# Altium project Hydrogen Bike BMS (100V).PrjPcb (part 3 of 3)

## Sheet Voltage_Sensing.SchDoc
size A; SheetNumber: 7; SheetTotal: 9
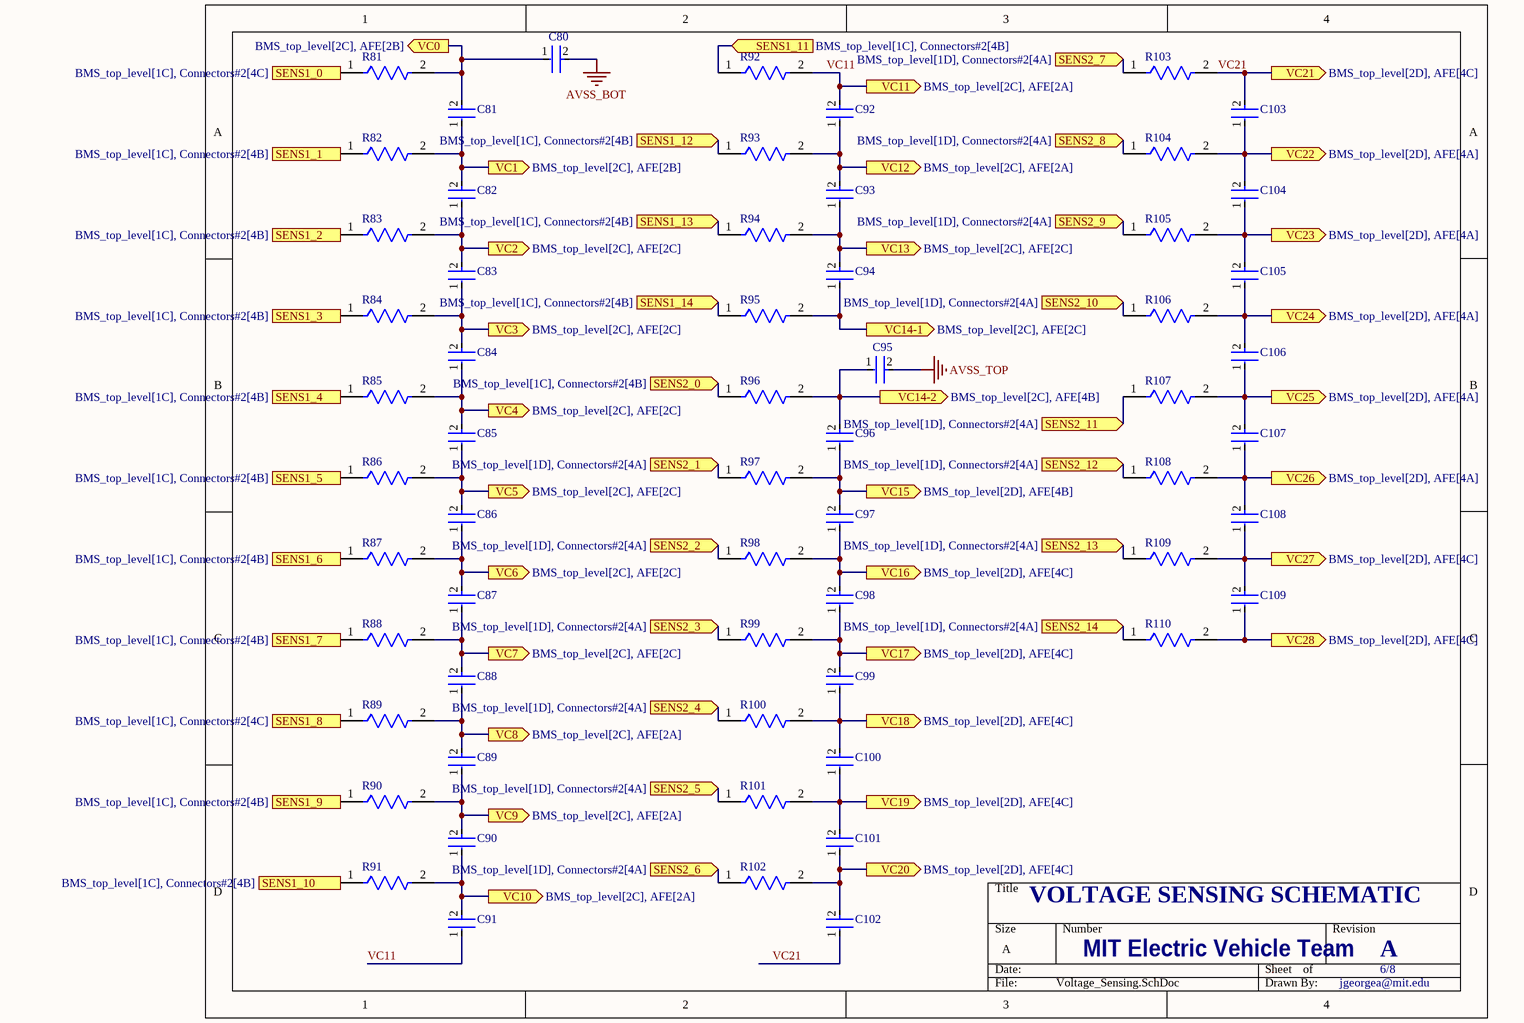
[diagram p7: Voltage_Sensing.SchDoc]

### Parts
C80  C1608X7R1C474K080AC  [FP-C1608-080-0_1-IPC_C]  (value not drawn)
C81  C1608X7R1C474K080AC  [FP-C1608-080-0_1-IPC_C]  (value not drawn)
C82  C1608X7R1C474K080AC  [FP-C1608-080-0_1-IPC_C]  (value not drawn)
C83  C1608X7R1C474K080AC  [FP-C1608-080-0_1-IPC_C]  (value not drawn)
C84  C1608X7R1C474K080AC  [FP-C1608-080-0_1-IPC_C]  (value not drawn)
C85  C1608X7R1C474K080AC  [FP-C1608-080-0_1-IPC_C]  (value not drawn)
C86  C1608X7R1C474K080AC  [FP-C1608-080-0_1-IPC_C]  (value not drawn)
C87  C1608X7R1C474K080AC  [FP-C1608-080-0_1-IPC_C]  (value not drawn)
C88  C1608X7R1C474K080AC  [FP-C1608-080-0_1-IPC_C]  (value not drawn)
C89  C1608X7R1C474K080AC  [FP-C1608-080-0_1-IPC_C]  (value not drawn)
C90  C1608X7R1C474K080AC  [FP-C1608-080-0_1-IPC_C]  (value not drawn)
C91  C1608X7R1C474K080AC  [FP-C1608-080-0_1-IPC_C]  (value not drawn)
C92  C1608X7R1C474K080AC  [FP-C1608-080-0_1-IPC_C]  (value not drawn)
C93  C1608X7R1C474K080AC  [FP-C1608-080-0_1-IPC_C]  (value not drawn)
C94  C1608X7R1C474K080AC  [FP-C1608-080-0_1-IPC_C]  (value not drawn)
C95  C1608X7R1C474K080AC  [FP-C1608-080-0_1-IPC_C]  (value not drawn)
C96  C1608X7R1C474K080AC  [FP-C1608-080-0_1-IPC_C]  (value not drawn)
C97  C1608X7R1C474K080AC  [FP-C1608-080-0_1-IPC_C]  (value not drawn)
C98  C1608X7R1C474K080AC  [FP-C1608-080-0_1-IPC_C]  (value not drawn)
C99  C1608X7R1C474K080AC  [FP-C1608-080-0_1-IPC_C]  (value not drawn)
C100  C1608X7R1C474K080AC  [FP-C1608-080-0_1-IPC_C]  (value not drawn)
C101  C1608X7R1C474K080AC  [FP-C1608-080-0_1-IPC_C]  (value not drawn)
C102  C1608X7R1C474K080AC  [FP-C1608-080-0_1-IPC_C]  (value not drawn)
C103  C1608X7R1C474K080AC  [FP-C1608-080-0_1-IPC_C]  (value not drawn)
C104  C1608X7R1C474K080AC  [FP-C1608-080-0_1-IPC_C]  (value not drawn)
C105  C1608X7R1C474K080AC  [FP-C1608-080-0_1-IPC_C]  (value not drawn)
C106  C1608X7R1C474K080AC  [FP-C1608-080-0_1-IPC_C]  (value not drawn)
C107  C1608X7R1C474K080AC  [FP-C1608-080-0_1-IPC_C]  (value not drawn)
C108  C1608X7R1C474K080AC  [FP-C1608-080-0_1-IPC_C]  (value not drawn)
C109  C1608X7R1C474K080AC  [FP-C1608-080-0_1-IPC_C]  (value not drawn)
R81  CRCW0805100RJNEAHP  [FP-CRCW0805-HPe3-IPC_C]  (value not drawn)
R82  CRCW0805100RJNEAHP  [FP-CRCW0805-HPe3-IPC_C]  (value not drawn)
R83  CRCW0805100RJNEAHP  [FP-CRCW0805-HPe3-IPC_C]  (value not drawn)
R84  CRCW0805100RJNEAHP  [FP-CRCW0805-HPe3-IPC_C]  (value not drawn)
R85  CRCW0805100RJNEAHP  [FP-CRCW0805-HPe3-IPC_C]  (value not drawn)
R86  CRCW0805100RJNEAHP  [FP-CRCW0805-HPe3-IPC_C]  (value not drawn)
R87  CRCW0805100RJNEAHP  [FP-CRCW0805-HPe3-IPC_C]  (value not drawn)
R88  CRCW0805100RJNEAHP  [FP-CRCW0805-HPe3-IPC_C]  (value not drawn)
R89  CRCW0805100RJNEAHP  [FP-CRCW0805-HPe3-IPC_C]  (value not drawn)
R90  CRCW0805100RJNEAHP  [FP-CRCW0805-HPe3-IPC_C]  (value not drawn)
R91  CRCW0805100RJNEAHP  [FP-CRCW0805-HPe3-IPC_C]  (value not drawn)
R92  CRCW0805100RJNEAHP  [FP-CRCW0805-HPe3-IPC_C]  (value not drawn)
R93  CRCW0805100RJNEAHP  [FP-CRCW0805-HPe3-IPC_C]  (value not drawn)
R94  CRCW0805100RJNEAHP  [FP-CRCW0805-HPe3-IPC_C]  (value not drawn)
R95  CRCW0805100RJNEAHP  [FP-CRCW0805-HPe3-IPC_C]  (value not drawn)
R96  CRCW0805100RJNEAHP  [FP-CRCW0805-HPe3-IPC_C]  (value not drawn)
R97  CRCW0805100RJNEAHP  [FP-CRCW0805-HPe3-IPC_C]  (value not drawn)
R98  CRCW0805100RJNEAHP  [FP-CRCW0805-HPe3-IPC_C]  (value not drawn)
R99  CRCW0805100RJNEAHP  [FP-CRCW0805-HPe3-IPC_C]  (value not drawn)
R100  CRCW0805100RJNEAHP  [FP-CRCW0805-HPe3-IPC_C]  (value not drawn)
R101  CRCW0805100RJNEAHP  [FP-CRCW0805-HPe3-IPC_C]  (value not drawn)
R102  CRCW0805100RJNEAHP  [FP-CRCW0805-HPe3-IPC_C]  (value not drawn)
R103  CRCW0805100RJNEAHP  [FP-CRCW0805-HPe3-IPC_C]  (value not drawn)
R104  CRCW0805100RJNEAHP  [FP-CRCW0805-HPe3-IPC_C]  (value not drawn)
R105  CRCW0805100RJNEAHP  [FP-CRCW0805-HPe3-IPC_C]  (value not drawn)
R106  CRCW0805100RJNEAHP  [FP-CRCW0805-HPe3-IPC_C]  (value not drawn)
R107  CRCW0805100RJNEAHP  [FP-CRCW0805-HPe3-IPC_C]  (value not drawn)
R108  CRCW0805100RJNEAHP  [FP-CRCW0805-HPe3-IPC_C]  (value not drawn)
R109  CRCW0805100RJNEAHP  [FP-CRCW0805-HPe3-IPC_C]  (value not drawn)
R110  CRCW0805100RJNEAHP  [FP-CRCW0805-HPe3-IPC_C]  (value not drawn)

### Ports
SENS1_0 (in, see BMS_top_level[1C], Connectors#2[4C]), SENS1_1 (in, see BMS_top_level[1C], Connectors#2[4B]), SENS1_2 (in, see BMS_top_level[1C], Connectors#2[4B]), SENS1_3 (in, see BMS_top_level[1C], Connectors#2[4B]), SENS1_4 (in, see BMS_top_level[1C], Connectors#2[4B]), SENS1_5 (in, see BMS_top_level[1C], Connectors#2[4B]), SENS1_6 (in, see BMS_top_level[1C], Connectors#2[4B]), SENS1_7 (in, see BMS_top_level[1C], Connectors#2[4B]), SENS1_8 (in, see BMS_top_level[1C], Connectors#2[4C]), SENS1_9 (in, see BMS_top_level[1C], Connectors#2[4B]), SENS1_10 (in, see BMS_top_level[1C], Connectors#2[4B]), SENS1_11 (in, see BMS_top_level[1C], Connectors#2[4B]), SENS1_12 (in, see BMS_top_level[1C], Connectors#2[4B]), SENS1_13 (in, see BMS_top_level[1C], Connectors#2[4B]), SENS1_14 (in, see BMS_top_level[1C], Connectors#2[4B]), SENS2_0 (in, see BMS_top_level[1C], Connectors#2[4B]), SENS2_1 (in, see BMS_top_level[1D], Connectors#2[4A]), SENS2_2 (in, see BMS_top_level[1D], Connectors#2[4A]), SENS2_3 (in, see BMS_top_level[1D], Connectors#2[4A]), SENS2_4 (in, see BMS_top_level[1D], Connectors#2[4A]), SENS2_5 (in, see BMS_top_level[1D], Connectors#2[4A]), SENS2_6 (in, see BMS_top_level[1D], Connectors#2[4A]), SENS2_7 (in, see BMS_top_level[1D], Connectors#2[4A]), SENS2_8 (in, see BMS_top_level[1D], Connectors#2[4A]), SENS2_9 (in, see BMS_top_level[1D], Connectors#2[4A]), SENS2_10 (in, see BMS_top_level[1D], Connectors#2[4A]), SENS2_11 (in, see BMS_top_level[1D], Connectors#2[4A]), SENS2_12 (in, see BMS_top_level[1D], Connectors#2[4A]), SENS2_13 (in, see BMS_top_level[1D], Connectors#2[4A]), SENS2_14 (in, see BMS_top_level[1D], Connectors#2[4A]), VC0 (out, see BMS_top_level[2C], AFE[2B]), VC1 (out, see BMS_top_level[2C], AFE[2B]), VC2 (out, see BMS_top_level[2C], AFE[2C]), VC3 (out, see BMS_top_level[2C], AFE[2C]), VC4 (out, see BMS_top_level[2C], AFE[2C]), VC5 (out, see BMS_top_level[2C], AFE[2C]), VC6 (out, see BMS_top_level[2C], AFE[2C]), VC7 (out, see BMS_top_level[2C], AFE[2C]), VC8 (out, see BMS_top_level[2C], AFE[2A]), VC9 (out, see BMS_top_level[2C], AFE[2A]), VC10 (out, see BMS_top_level[2C], AFE[2A]), VC11 (out, see BMS_top_level[2C], AFE[2A]), VC12 (out, see BMS_top_level[2C], AFE[2A]), VC13 (out, see BMS_top_level[2C], AFE[2C]), VC14-1 (out, see BMS_top_level[2C], AFE[2C]), VC14-2 (out, see BMS_top_level[2C], AFE[4B]), VC15 (out, see BMS_top_level[2D], AFE[4B]), VC16 (out, see BMS_top_level[2D], AFE[4C]), VC17 (out, see BMS_top_level[2D], AFE[4C]), VC18 (out, see BMS_top_level[2D], AFE[4C]), VC19 (out, see BMS_top_level[2D], AFE[4C]), VC20 (out, see BMS_top_level[2D], AFE[4C]), VC21 (out, see BMS_top_level[2D], AFE[4C]), VC22 (out, see BMS_top_level[2D], AFE[4A]), VC23 (out, see BMS_top_level[2D], AFE[4A]), VC24 (out, see BMS_top_level[2D], AFE[4A]), VC25 (out, see BMS_top_level[2D], AFE[4A]), VC26 (out, see BMS_top_level[2D], AFE[4A]), VC27 (out, see BMS_top_level[2D], AFE[4C]), VC28 (out, see BMS_top_level[2D], AFE[4C])

### Nets
AVSS_BOT: C80.2
AVSS_TOP: C95.2
VC11: C91.1 C92.2 R92.2 ; port VC11
VC21: C102.1 C103.2 R103.2 ; port VC21
NetC80_1: C80.1 C81.2 R81.2 ; port VC0
NetC81_1: C81.1 C82.2 R82.2 ; port VC1
NetC82_1: C82.1 C83.2 R83.2 ; port VC2
NetC83_1: C83.1 C84.2 R84.2 ; port VC3
NetC84_1: C84.1 C85.2 R85.2 ; port VC4
NetC85_1: C85.1 C86.2 R86.2 ; port VC5
NetC86_1: C86.1 C87.2 R87.2 ; port VC6
NetC87_1: C87.1 C88.2 R88.2 ; port VC7
NetC88_1: C88.1 C89.2 R89.2 ; port VC8
NetC89_1: C89.1 C90.2 R90.2 ; port VC9
NetC90_1: C90.1 C91.2 R91.2 ; port VC10
NetC92_1: C92.1 C93.2 R93.2 ; port VC12
NetC93_1: C93.1 C94.2 R94.2 ; port VC13
NetC94_1: C94.1 R95.2 ; port VC14-1
NetC95_1: C95.1 C96.2 R96.2 ; port VC14-2
NetC96_1: C96.1 C97.2 R97.2 ; port VC15
NetC97_1: C97.1 C98.2 R98.2 ; port VC16
NetC98_1: C98.1 C99.2 R99.2 ; port VC17
NetC99_1: C99.1 C100.2 R100.2 ; port VC18
NetC100_1: C100.1 C101.2 R101.2 ; port VC19
NetC101_1: C101.1 C102.2 R102.2 ; port VC20
NetC103_1: C103.1 C104.2 R104.2 ; port VC22
NetC104_1: C104.1 C105.2 R105.2 ; port VC23
NetC105_1: C105.1 C106.2 R106.2 ; port VC24
NetC106_1: C106.1 C107.2 R107.2 ; port VC25
NetC107_1: C107.1 C108.2 R108.2 ; port VC26
NetC108_1: C108.1 C109.2 R109.2 ; port VC27
NetC109_1: C109.1 R110.2 ; port VC28
NetJ6_1: R96.1 ; port SENS2_0
NetJ6_2: R97.1 ; port SENS2_1
NetJ6_3: R98.1 ; port SENS2_2
NetJ6_4: R99.1 ; port SENS2_3
NetJ6_5: R100.1 ; port SENS2_4
NetJ6_6: R101.1 ; port SENS2_5
NetJ6_7: R102.1 ; port SENS2_6
NetJ6_8: R103.1 ; port SENS2_7
NetJ6_9: R104.1 ; port SENS2_8
NetJ6_10: R105.1 ; port SENS2_9
NetJ6_11: R106.1 ; port SENS2_10
NetJ6_12: R107.1 ; port SENS2_11
NetJ6_13: R108.1 ; port SENS2_12
NetJ6_14: R109.1 ; port SENS2_13
NetJ6_15: R110.1 ; port SENS2_14
NetJ7_1: R81.1 ; port SENS1_0
NetJ7_2: R82.1 ; port SENS1_1
NetJ7_3: R83.1 ; port SENS1_2
NetJ7_4: R84.1 ; port SENS1_3
NetJ7_5: R85.1 ; port SENS1_4
NetJ7_6: R86.1 ; port SENS1_5
NetJ7_7: R87.1 ; port SENS1_6
NetJ7_8: R88.1 ; port SENS1_7
NetJ7_9: R89.1 ; port SENS1_8
NetJ7_10: R90.1 ; port SENS1_9
NetJ7_11: R91.1 ; port SENS1_10
NetJ7_12: R92.1 ; port SENS1_11
NetJ7_13: R93.1 ; port SENS1_12
NetJ7_14: R94.1 ; port SENS1_13
NetJ7_15: R95.1 ; port SENS1_14

### Notes on the sheet
- VOLTAGE SENSING SCHEMATIC
- MIT Electric Vehicle Team
- A
- 6/8
- jgeorgea@mit.edu

### Library data of the parts
C80-C109 = CMP-08246-006173-1: Multilayer Ceramic Capacitors 470nF ±10% 16V X7R SMD 0603; REACH SVHC: No SVHC; Number of Pins: 2; Thickness: 0.037inch; Lead Free: Lead Free; Voltage: 16V; Case Code (Imperial): 0603; Capacitance: 470nF; Length: 1.6mm; Dielectric: X7R; Resistor Type: Ceramic; Weight: 7.1E-05oz; Termination: SMD/SMT; Radiation Hardening: No; RoHS Compliant: Yes; Dielectric Material: Ceramic; Case Code (Metric): 1608; Construction: Flat; Voltage Rating (DC): 16V; Package Quantity: 1; Mount: Surface Mount; Min Operating Temperature: -55°C; Case/Package: 0603; Series: C; Max Operating Temperature: 125°C; Depth: 0.8mm; Voltage Rating: 16V; Width: 0.031inch; Tolerance: 10%; Height: 0.8mm; Packaging: Tape and Reel
R81-R110 = CMP-02407-002130-1: RES Thick Film, 100Ω, 5%, 0.5W, 200ppm/°C, 0805; Voltage Rating: 150V; Resistance: 100R; Power Rating: 330mW; Max Power Dissipation: 333mW; Max Operating Temperature: 155°C; Temperature Coefficient: 200ppm/°C; Case Code (Imperial): 0805; Lead Free: Lead Free; Composition: Thick Film; Case/Package: 0805; Package Quantity: 1; Number of Terminations: 2; Contact Plating: Tin; Radiation Hardening: No; Case Code (Metric): 2012; Height: 0.024inch; Features: Automotive AEC-Q200; Length: 0.079inch; Tolerance: 5%; Width: 0.049inch; Packaging: Tape and Reel; Termination: SMD/SMT; Weight: 0.000194oz; Min Operating Temperature: -55°C

## Sheet Connectors#2.SchDoc
size A; SheetNumber: 9; SheetTotal: 9
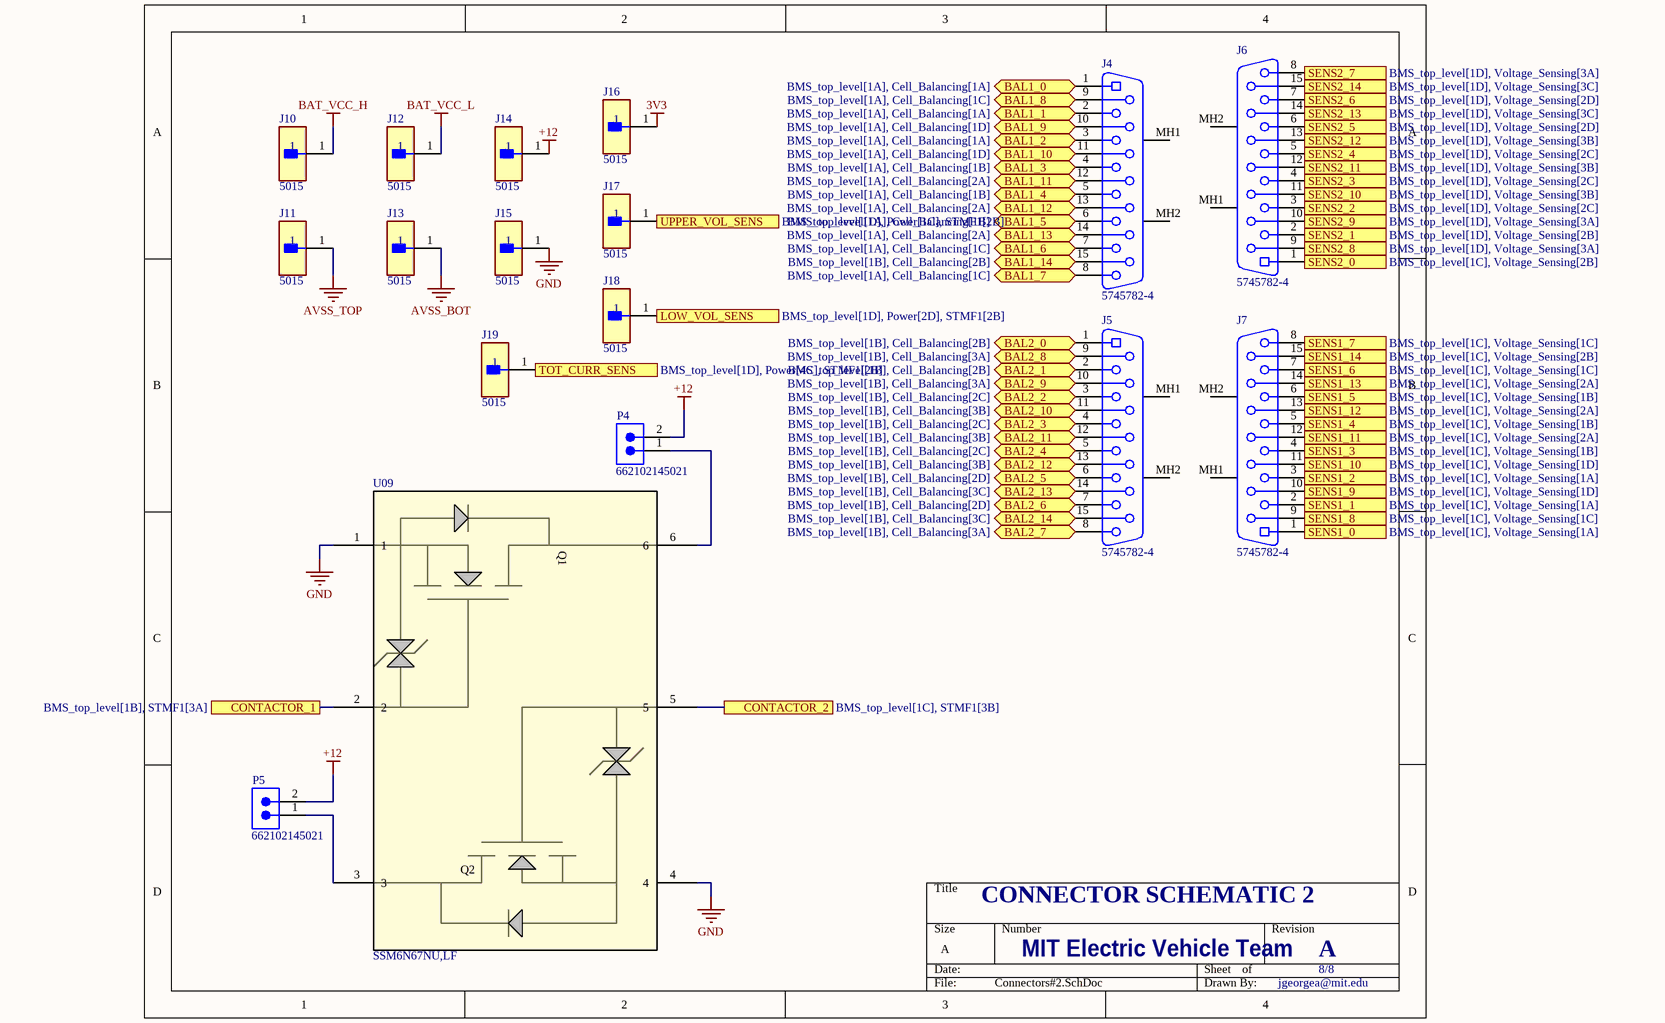
[diagram p8: Connectors#2.SchDoc]

### Parts
J4  5745782-4  [TECO-5745782-4_V]
J5  5745782-4  [TECO-5745782-4_V]
J6  5745782-4  [TECO-5745782-4_V]
J7  5745782-4  [TECO-5745782-4_V]
J10  5015  [FP-5015-MFG]
J11  5015  [FP-5015-MFG]
J12  5015  [FP-5015-MFG]
J13  5015  [FP-5015-MFG]
J14  5015  [FP-5015-MFG]
J15  5015  [FP-5015-MFG]
J16  5015  [FP-5015-MFG]
J17  5015  [FP-5015-MFG]
J18  5015  [FP-5015-MFG]
J19  5015  [FP-5015-MFG]
P4  662102145021  [662102145021]
P5  662102145021  [662102145021]
U09  SSM6N67NU,LF  [UDFN6_TOS]

### Ports
BAL1_0 (bidir, see BMS_top_level[1A], Cell_Balancing[1A]), BAL1_1 (bidir, see BMS_top_level[1A], Cell_Balancing[1A]), BAL1_2 (bidir, see BMS_top_level[1A], Cell_Balancing[1A]), BAL1_3 (bidir, see BMS_top_level[1A], Cell_Balancing[1B]), BAL1_4 (bidir, see BMS_top_level[1A], Cell_Balancing[1B]), BAL1_5 (bidir, see BMS_top_level[1A], Cell_Balancing[1B]), BAL1_6 (bidir, see BMS_top_level[1A], Cell_Balancing[1C]), BAL1_7 (bidir, see BMS_top_level[1A], Cell_Balancing[1C]), BAL1_8 (bidir, see BMS_top_level[1A], Cell_Balancing[1C]), BAL1_9 (bidir, see BMS_top_level[1A], Cell_Balancing[1D]), BAL1_10 (bidir, see BMS_top_level[1A], Cell_Balancing[1D]), BAL1_11 (bidir, see BMS_top_level[1A], Cell_Balancing[2A]), BAL1_12 (bidir, see BMS_top_level[1A], Cell_Balancing[2A]), BAL1_13 (bidir, see BMS_top_level[1A], Cell_Balancing[2A]), BAL1_14 (bidir, see BMS_top_level[1B], Cell_Balancing[2B]), BAL2_0 (bidir, see BMS_top_level[1B], Cell_Balancing[2B]), BAL2_1 (bidir, see BMS_top_level[1B], Cell_Balancing[2B]), BAL2_2 (bidir, see BMS_top_level[1B], Cell_Balancing[2C]), BAL2_3 (bidir, see BMS_top_level[1B], Cell_Balancing[2C]), BAL2_4 (bidir, see BMS_top_level[1B], Cell_Balancing[2C]), BAL2_5 (bidir, see BMS_top_level[1B], Cell_Balancing[2D]), BAL2_6 (bidir, see BMS_top_level[1B], Cell_Balancing[2D]), BAL2_7 (bidir, see BMS_top_level[1B], Cell_Balancing[3A]), BAL2_8 (bidir, see BMS_top_level[1B], Cell_Balancing[3A]), BAL2_9 (bidir, see BMS_top_level[1B], Cell_Balancing[3A]), BAL2_10 (bidir, see BMS_top_level[1B], Cell_Balancing[3B]), BAL2_11 (bidir, see BMS_top_level[1B], Cell_Balancing[3B]), BAL2_12 (bidir, see BMS_top_level[1B], Cell_Balancing[3B]), BAL2_13 (bidir, see BMS_top_level[1B], Cell_Balancing[3C]), BAL2_14 (bidir, see BMS_top_level[1B], Cell_Balancing[3C]), CONTACTOR_1 (see BMS_top_level[1B], STMF1[3A]), CONTACTOR_2 (see BMS_top_level[1C], STMF1[3B]), LOW_VOL_SENS (in, see BMS_top_level[1D], Power[2D], STMF1[2B]), SENS1_0 (out, see BMS_top_level[1C], Voltage_Sensing[1A]), SENS1_1 (out, see BMS_top_level[1C], Voltage_Sensing[1A]), SENS1_2 (out, see BMS_top_level[1C], Voltage_Sensing[1A]), SENS1_3 (out, see BMS_top_level[1C], Voltage_Sensing[1B]), SENS1_4 (out, see BMS_top_level[1C], Voltage_Sensing[1B]), SENS1_5 (out, see BMS_top_level[1C], Voltage_Sensing[1B]), SENS1_6 (out, see BMS_top_level[1C], Voltage_Sensing[1C]), SENS1_7 (out, see BMS_top_level[1C], Voltage_Sensing[1C]), SENS1_8 (out, see BMS_top_level[1C], Voltage_Sensing[1C]), SENS1_9 (out, see BMS_top_level[1C], Voltage_Sensing[1D]), SENS1_10 (out, see BMS_top_level[1C], Voltage_Sensing[1D]), SENS1_11 (out, see BMS_top_level[1C], Voltage_Sensing[2A]), SENS1_12 (out, see BMS_top_level[1C], Voltage_Sensing[2A]), SENS1_13 (out, see BMS_top_level[1C], Voltage_Sensing[2A]), SENS1_14 (out, see BMS_top_level[1C], Voltage_Sensing[2B]), SENS2_0 (out, see BMS_top_level[1C], Voltage_Sensing[2B]), SENS2_1 (out, see BMS_top_level[1D], Voltage_Sensing[2B]), SENS2_2 (out, see BMS_top_level[1D], Voltage_Sensing[2C]), SENS2_3 (out, see BMS_top_level[1D], Voltage_Sensing[2C]), SENS2_4 (out, see BMS_top_level[1D], Voltage_Sensing[2C]), SENS2_5 (out, see BMS_top_level[1D], Voltage_Sensing[2D]), SENS2_6 (out, see BMS_top_level[1D], Voltage_Sensing[2D]), SENS2_7 (out, see BMS_top_level[1D], Voltage_Sensing[3A]), SENS2_8 (out, see BMS_top_level[1D], Voltage_Sensing[3A]), SENS2_9 (out, see BMS_top_level[1D], Voltage_Sensing[3A]), SENS2_10 (out, see BMS_top_level[1D], Voltage_Sensing[3B]), SENS2_11 (out, see BMS_top_level[1D], Voltage_Sensing[3B]), SENS2_12 (out, see BMS_top_level[1D], Voltage_Sensing[3B]), SENS2_13 (out, see BMS_top_level[1D], Voltage_Sensing[3C]), SENS2_14 (out, see BMS_top_level[1D], Voltage_Sensing[3C]), TOT_CURR_SENS (in, see BMS_top_level[1D], Power[4C], STMF1[2B]), UPPER_VOL_SENS (in, see BMS_top_level[1D], Power[1C], STMF1[2B])

### Nets
3V3: J16.1
+12: J14.1 P4.2 P5.2
AVSS_BOT: J13.1
AVSS_TOP: J11.1
BAT_VCC_H: J10.1
BAT_VCC_L: J12.1
GND: J15.1 U09.1 U09.4
CON1: U09.2 ; port CONTACTOR_1
CON2: U09.5 ; port CONTACTOR_2
LOW_VOL: J18.1 ; port LOW_VOL_SENS
TOT_CURR: J19.1 ; port TOT_CURR_SENS
UPPER_VOL: J17.1 ; port UPPER_VOL_SENS
NetJ4_1: J4.1 ; port BAL1_0
NetJ4_2: J4.2 ; port BAL1_1
NetJ4_3: J4.3 ; port BAL1_2
NetJ4_4: J4.4 ; port BAL1_3
NetJ4_5: J4.5 ; port BAL1_4
NetJ4_6: J4.6 ; port BAL1_5
NetJ4_7: J4.7 ; port BAL1_6
NetJ4_8: J4.8 ; port BAL1_7
NetJ4_9: J4.9 ; port BAL1_8
NetJ4_10: J4.10 ; port BAL1_9
NetJ4_11: J4.11 ; port BAL1_10
NetJ4_12: J4.12 ; port BAL1_11
NetJ4_13: J4.13 ; port BAL1_12
NetJ4_14: J4.14 ; port BAL1_13
NetJ4_15: J4.15 ; port BAL1_14
NetJ5_1: J5.1 ; port BAL2_0
NetJ5_2: J5.2 ; port BAL2_1
NetJ5_3: J5.3 ; port BAL2_2
NetJ5_4: J5.4 ; port BAL2_3
NetJ5_5: J5.5 ; port BAL2_4
NetJ5_6: J5.6 ; port BAL2_5
NetJ5_7: J5.7 ; port BAL2_6
NetJ5_8: J5.8 ; port BAL2_7
NetJ5_9: J5.9 ; port BAL2_8
NetJ5_10: J5.10 ; port BAL2_9
NetJ5_11: J5.11 ; port BAL2_10
NetJ5_12: J5.12 ; port BAL2_11
NetJ5_13: J5.13 ; port BAL2_12
NetJ5_14: J5.14 ; port BAL2_13
NetJ5_15: J5.15 ; port BAL2_14
NetJ6_1: J6.1 ; port SENS2_0
NetJ6_2: J6.2 ; port SENS2_1
NetJ6_3: J6.3 ; port SENS2_2
NetJ6_4: J6.4 ; port SENS2_3
NetJ6_5: J6.5 ; port SENS2_4
NetJ6_6: J6.6 ; port SENS2_5
NetJ6_7: J6.7 ; port SENS2_6
NetJ6_8: J6.8 ; port SENS2_7
NetJ6_9: J6.9 ; port SENS2_8
NetJ6_10: J6.10 ; port SENS2_9
NetJ6_11: J6.11 ; port SENS2_10
NetJ6_12: J6.12 ; port SENS2_11
NetJ6_13: J6.13 ; port SENS2_12
NetJ6_14: J6.14 ; port SENS2_13
NetJ6_15: J6.15 ; port SENS2_14
NetJ7_1: J7.1 ; port SENS1_0
NetJ7_2: J7.2 ; port SENS1_1
NetJ7_3: J7.3 ; port SENS1_2
NetJ7_4: J7.4 ; port SENS1_3
NetJ7_5: J7.5 ; port SENS1_4
NetJ7_6: J7.6 ; port SENS1_5
NetJ7_7: J7.7 ; port SENS1_6
NetJ7_8: J7.8 ; port SENS1_7
NetJ7_9: J7.9 ; port SENS1_8
NetJ7_10: J7.10 ; port SENS1_9
NetJ7_11: J7.11 ; port SENS1_10
NetJ7_12: J7.12 ; port SENS1_11
NetJ7_13: J7.13 ; port SENS1_12
NetJ7_14: J7.14 ; port SENS1_13
NetJ7_15: J7.15 ; port SENS1_14
NetP4_1: P4.1 U09.6
NetP5_1: P5.1 U09.3

Not connected (* = marked no-connect by the designer): J4 MH1 MH2; J5 MH1 MH2; J6 MH1 MH2; J7 MH1 MH2

### Notes on the sheet
- CONNECTOR SCHEMATIC 2
- MIT Electric Vehicle Team
- A
- 8/8
- jgeorgea@mit.edu
- (in symbol SSM6N67NU,LF) Q1; Q2

### Library data of the parts
J4-J7 = CMP-2000-05646-1: Female D-Sub Connector, Pitch 2.74 mm, 2 Row, 15 Position, Height 12.93 mm, Tail Length 3.18 mm, -55 to 105 degC, RoHS, Tray; Manufacturer: TE Connectivity; Voltage Rating: 125V; Featured Product: AMPLIMITED-SubminiatureConnectors; Flange Feature: Housing/Shell(4-40); Current Rating: 6A; Number of Positions: 15; Catalog Drawings: AMPD-SubMale.318; Mating Products: 1-745494-8-ND / -CONNPLUG15POS26-22AWGGOLD/FL / A34118-ND / -CONND-SUBPLUG15P22-26AWGAU / A32503-ND / -CONNDSUBPLUG15POSSLDCUP / AMR15B-ND / -CONND-SUBPLUG15POSGOLD / AML15B-ND / -CONND-SUBPLUG15POSGOLD / A31968-ND / -CONND-SUBPLUG15P22-26AWGAU / A31967-ND / -CONND-SUBPLUG15P26-30AWGAU; Connector Type: Receptacle,FemaleSockets; Dynamic Catalog: AMPLIMITEHD-20Series; 3D Model: 5745782-4.pdf; Other Names: A32076; Product Training Modules: AMPLIMITED-SubConnectors; Features: GroundStrap; Termination: Solder; Mounting Type: ThroughHole,RightAngle; Contact Finish Thickness: 30µin(0.76µm); Shell Material, Finish: Steel,TinPlated; Category: Connectors,Interconnects; Shell Size, Connector Layout: 2(DA,A); Package Description: Female D-Sub Connector, Pitch 2.74 mm, 2 Row, 15 Position, Height 12.93 mm, Tail Length 3.18 mm; Color: Black; Family: D-SubConnectors; Series: AMPLIMITEHD-20; Contact Finish: Gold; Mounting Technology: ThroughHole; Housing Material: Thermoplastic; Package Reference: 5745782-4; RoHS Information: 5745782-4StatementofCompliance; Standard Package: 104; Datasheet Version: Rev. R, 08/2011; Manufacturer URL: http://www.te.com/; Number of Rows: 2; Operating Temperature: -55°C~105°C; Connector Style: D-Sub; Datasheet URL: http://www.te.com/commerce/DocumentDelivery/DDEController?Action=srchrtrv&DocNm=5745782&DocType=Customer+Drawing&DocLang=English; Contact Type: Signal
J10-J19 = CMP-2000-05183-2: PC TEST POINT MINIATURE; Manufacturer: keystone; Number Of Contacts: 1; Conn Orientation: Straight; Category: Conn; Manufacturer Part Number: 5015; Digikey Description: PC TEST POINT MINIATURE; Automotive: No; Lead Free: Yes; Octopart: https://octopart.com/5015-keystone-3822; ComponentLink2URL: http://www.keyelco.com/product-pdf.cfm?p=1353; Package: 5015; RoHS: TRUE; Device Class L3: unset; Device Class L2: unset; Contact Material: Silver; Device Class L1: Connectors; Height: 1.65mm; ComponentLink2Description: Datasheet
P4 P5 = CMP-1502-00482-2: NexarPartId: 23024781; Pitch: 3mm; Number of Contacts: 2; Operating Supply Voltage: 250V; Gender: Male; Current Rating: 5A; Contact Resistance: 10mΩ; Insulation Resistance: 1GΩ; Connector Type: Male Pin, Socket; Min Operating Temperature: -40°C; Width: 3.85mm; Termination: Solder; REACH SVHC: Unknown; Contact Material: Copper; Number of Pins: 2; Lead Pitch: 3mm; Number of Rows: 1; Height: 14mm; Color: Black; Number of Positions: 2; RoHS: Compliant; Max Operating Temperature: 105°C; Length: 9.65mm; Mount: Surface Mount; Packaging: Tape and Reel; Contact Plating: Tin; Fastening Type: Ramp
U09 = SSM6N67NU,LF: No Description Available; Mfr_Name: Toshiba Electronic Devices & Storage Corp.; RefDes: RefDes; Type: Type

## Nets that join several sheets
3V3: Communication (5 pins), STMF1 (15 pins), Connectors#1 (8 pins), Power (12 pins), Connectors#2 (J16.1)
5V_ISO: Communication (C41.1 C43.1 U41.3 U42.8), Connectors#1 (J3.1), Power (C57.2 U03.5)
+12: Power (6 pins), Connectors#2 (J14.1 P4.2 P5.2)
AVSS_BOT: Communication (5 pins), Connectors#1 (MP4.1 P1.4), AFE (13 pins), Power (15 pins), Cell_Balancing (C76.1), Voltage_Sensing (C80.2), Connectors#2 (J13.1)
AVSS_TOP: Communication (C53.1 C54.1), Connectors#1 (MP2.1), AFE (13 pins), Power (11 pins), Cell_Balancing (C77.1), Voltage_Sensing (C95.2), Connectors#2 (J11.1)
BAT_BOT: AFE (U11.1), Power (C37.1 R37.2)
BAT_TOP: AFE (U12.1), Power (C36.1 R36.2)
BAT_VCC_H: Connectors#1 (MP1.1), AFE (R501.2), Power (5 pins), Connectors#2 (J10.1)
BAT_VCC_L: Connectors#1 (MP3.1), AFE (R500.2), Power (9 pins), Connectors#2 (J12.1)
CAN_GND: Communication (C43.2 U41.2 U41.8 U42.5), Connectors#1 (J3.2), Power (C57.1 U03.4)
CVDD_BOT: Communication (5 pins), AFE (C300.1 U11.45)
GND: Communication (5 pins), STMF1 (18 pins), Connectors#1 (12 pins), Power (22 pins), Connectors#2 (J15.1 U09.1 U09.4)
SYS_VSS: Connectors#1 (MP5.1), Power (U04.4)
AFE_NFAULT: Communication (R42.2 U43.4), AFE (U11.62)
AFE_UART_N: Communication (R43.2 U43.6), AFE (U11.52)
AFE_UART_P: Communication (U43.3), AFE (U11.53)
CAN1_N: Communication (U42.3), STMF1 (U01.45)
CAN1_P: Communication (U42.2), STMF1 (U01.44)
CAN_N: Communication (R41.1 U41.6), Connectors#1 (J3.4)
CAN_P: Communication (R41.2 U41.7), Connectors#1 (J3.3)
CB11: AFE (U11.12), Cell_Balancing (C31.1 C32.2 R32.2)
CB21: AFE (U12.20), Cell_Balancing (C67.1 C68.2 R68.2)
COMH_BOT_N: Communication (C52.2 R51.1 R54.1), AFE (U11.42)
COMH_BOT_P: Communication (C51.2 R51.2 R53.1), AFE (U11.43)
COML_TOP_N: Communication (C54.2 R52.1 R56.2), AFE (U12.41)
COML_TOP_P: Communication (C53.2 R52.2 R55.2), AFE (U12.40)
CON1: STMF1 (U01.30), Connectors#2 (U09.2)
CON2: STMF1 (U01.33), Connectors#2 (U09.5)
JTCK: STMF1 (U01.49), Connectors#1 (J1.2 P3.6)
JTMS: STMF1 (U01.46), Connectors#1 (J1.4 P3.4)
LOW_VOL: STMF1 (U01.10), Power (C154.2 R154.2 U17.4), Connectors#2 (J18.1)
NetC21_1: AFE (U11.32), Cell_Balancing (C21.1 C22.2 R22.2)
NetC21_2: AFE (U11.34), Cell_Balancing (C21.2 C76.2 R21.2)
NetC22_1: AFE (U11.30), Cell_Balancing (C22.1 C23.2 R23.2)
NetC23_1: AFE (U11.28), Cell_Balancing (C23.1 C24.2 R24.2)
NetC24_1: AFE (U11.26), Cell_Balancing (C24.1 C25.2 R25.2)
NetC25_1: AFE (U11.24), Cell_Balancing (C25.1 C26.2 R26.2)
NetC26_1: AFE (U11.22), Cell_Balancing (C26.1 C27.2 R27.2)
NetC27_1: AFE (U11.20), Cell_Balancing (C27.1 C28.2 R28.2)
NetC28_1: AFE (U11.18), Cell_Balancing (C28.1 C29.2 R29.2)
NetC29_1: AFE (U11.16), Cell_Balancing (C29.1 C30.2 R30.2)
NetC30_1: AFE (U11.14), Cell_Balancing (C30.1 C31.2 R31.2)
NetC32_1: AFE (U11.10), Cell_Balancing (C32.1 C33.2 R33.2)
NetC33_1: AFE (U11.8), Cell_Balancing (C33.1 C34.2 R34.2)
NetC34_1: AFE (U11.6), Cell_Balancing (C34.1 R35.2)
NetC61_1: AFE (U12.32), Cell_Balancing (C61.1 C62.2 R62.2)
NetC61_2: AFE (U12.34), Cell_Balancing (C61.2 C77.2 R61.2)
NetC62_1: AFE (U12.30), Cell_Balancing (C62.1 C63.2 R63.2)
NetC63_1: AFE (U12.28), Cell_Balancing (C63.1 C64.2 R64.2)
NetC64_1: AFE (U12.26), Cell_Balancing (C64.1 C65.2 R65.2)
NetC65_1: AFE (U12.24), Cell_Balancing (C65.1 C66.2 R66.2)
NetC66_1: AFE (U12.22), Cell_Balancing (C66.1 C67.2 R67.2)
NetC68_1: AFE (U12.18), Cell_Balancing (C68.1 C70.2 R70.2)
NetC70_1: AFE (U12.16), Cell_Balancing (C70.1 C71.2 R71.2)
NetC71_1: AFE (U12.14), Cell_Balancing (C71.1 C72.2 R72.2)
NetC72_1: AFE (U12.12), Cell_Balancing (C72.1 C73.2 R73.2)
NetC73_1: AFE (U12.10), Cell_Balancing (C73.1 C74.2 R74.2)
NetC74_1: AFE (U12.8), Cell_Balancing (C74.1 C75.2 R75.2)
NetC75_1: AFE (U12.6), Cell_Balancing (C75.1 R76.2)
NetC80_1: AFE (U11.35), Voltage_Sensing (C80.1 C81.2 R81.2)
NetC81_1: AFE (U11.33), Voltage_Sensing (C81.1 C82.2 R82.2)
NetC82_1: AFE (U11.31), Voltage_Sensing (C82.1 C83.2 R83.2)
NetC83_1: AFE (U11.29), Voltage_Sensing (C83.1 C84.2 R84.2)
NetC84_1: AFE (U11.27), Voltage_Sensing (C84.1 C85.2 R85.2)
NetC85_1: AFE (U11.25), Voltage_Sensing (C85.1 C86.2 R86.2)
NetC86_1: AFE (U11.23), Voltage_Sensing (C86.1 C87.2 R87.2)
NetC87_1: AFE (U11.21), Voltage_Sensing (C87.1 C88.2 R88.2)
NetC88_1: AFE (U11.19), Voltage_Sensing (C88.1 C89.2 R89.2)
NetC89_1: AFE (U11.17), Voltage_Sensing (C89.1 C90.2 R90.2)
NetC90_1: AFE (U11.15), Voltage_Sensing (C90.1 C91.2 R91.2)
NetC92_1: AFE (U11.11), Voltage_Sensing (C92.1 C93.2 R93.2)
NetC93_1: AFE (U11.9), Voltage_Sensing (C93.1 C94.2 R94.2)
NetC94_1: AFE (U11.7), Voltage_Sensing (C94.1 R95.2)
NetC95_1: AFE (U12.35), Voltage_Sensing (C95.1 C96.2 R96.2)
NetC96_1: AFE (U12.33), Voltage_Sensing (C96.1 C97.2 R97.2)
NetC97_1: AFE (U12.31), Voltage_Sensing (C97.1 C98.2 R98.2)
NetC98_1: AFE (U12.29), Voltage_Sensing (C98.1 C99.2 R99.2)
NetC99_1: AFE (U12.27), Voltage_Sensing (C99.1 C100.2 R100.2)
NetC100_1: AFE (U12.25), Voltage_Sensing (C100.1 C101.2 R101.2)
NetC101_1: AFE (U12.23), Voltage_Sensing (C101.1 C102.2 R102.2)
NetC103_1: AFE (U12.19), Voltage_Sensing (C103.1 C104.2 R104.2)
NetC104_1: AFE (U12.17), Voltage_Sensing (C104.1 C105.2 R105.2)
NetC105_1: AFE (U12.15), Voltage_Sensing (C105.1 C106.2 R106.2)
NetC106_1: AFE (U12.13), Voltage_Sensing (C106.1 C107.2 R107.2)
NetC107_1: AFE (U12.11), Voltage_Sensing (C107.1 C108.2 R108.2)
NetC108_1: AFE (U12.9), Voltage_Sensing (C108.1 C109.2 R109.2)
NetC109_1: AFE (U12.7), Voltage_Sensing (C109.1 R110.2)
NetJ2_2: STMF1 (U01.20), Connectors#1 (J2.2 R08.1)
NetJ2_3: STMF1 (U01.23), Connectors#1 (J2.3 R06.1)
NetJ2_5: STMF1 (U01.21), Connectors#1 (J2.5 R05.1)
NetJ2_7: STMF1 (U01.22), Connectors#1 (J2.7 R07.1)
NetJ2_10: STMF1 (U01.50), Connectors#1 (J2.10 R04.1)
NetJ4_1: Cell_Balancing (R21.1), Connectors#2 (J4.1)
NetJ4_2: Cell_Balancing (R22.1), Connectors#2 (J4.2)
NetJ4_3: Cell_Balancing (R23.1), Connectors#2 (J4.3)
NetJ4_4: Cell_Balancing (R24.1), Connectors#2 (J4.4)
NetJ4_5: Cell_Balancing (R25.1), Connectors#2 (J4.5)
NetJ4_6: Cell_Balancing (R26.1), Connectors#2 (J4.6)
NetJ4_7: Cell_Balancing (R27.1), Connectors#2 (J4.7)
NetJ4_8: Cell_Balancing (R28.1), Connectors#2 (J4.8)
NetJ4_9: Cell_Balancing (R29.1), Connectors#2 (J4.9)
NetJ4_10: Cell_Balancing (R30.1), Connectors#2 (J4.10)
NetJ4_11: Cell_Balancing (R31.1), Connectors#2 (J4.11)
NetJ4_12: Cell_Balancing (R32.1), Connectors#2 (J4.12)
NetJ4_13: Cell_Balancing (R33.1), Connectors#2 (J4.13)
NetJ4_14: Cell_Balancing (R34.1), Connectors#2 (J4.14)
NetJ4_15: Cell_Balancing (R35.1), Connectors#2 (J4.15)
NetJ5_1: Cell_Balancing (R61.1), Connectors#2 (J5.1)
NetJ5_2: Cell_Balancing (R62.1), Connectors#2 (J5.2)
NetJ5_3: Cell_Balancing (R63.1), Connectors#2 (J5.3)
NetJ5_4: Cell_Balancing (R64.1), Connectors#2 (J5.4)
NetJ5_5: Cell_Balancing (R65.1), Connectors#2 (J5.5)
NetJ5_6: Cell_Balancing (R66.1), Connectors#2 (J5.6)
NetJ5_7: Cell_Balancing (R67.1), Connectors#2 (J5.7)
NetJ5_8: Cell_Balancing (R68.1), Connectors#2 (J5.8)
NetJ5_9: Cell_Balancing (R70.1), Connectors#2 (J5.9)
NetJ5_10: Cell_Balancing (R71.1), Connectors#2 (J5.10)
NetJ5_11: Cell_Balancing (R72.1), Connectors#2 (J5.11)
NetJ5_12: Cell_Balancing (R73.1), Connectors#2 (J5.12)
NetJ5_13: Cell_Balancing (R74.1), Connectors#2 (J5.13)
NetJ5_14: Cell_Balancing (R75.1), Connectors#2 (J5.14)
NetJ5_15: Cell_Balancing (R76.1), Connectors#2 (J5.15)
NetJ6_1: Voltage_Sensing (R96.1), Connectors#2 (J6.1)
NetJ6_2: Voltage_Sensing (R97.1), Connectors#2 (J6.2)
NetJ6_3: Voltage_Sensing (R98.1), Connectors#2 (J6.3)
NetJ6_4: Voltage_Sensing (R99.1), Connectors#2 (J6.4)
NetJ6_5: Voltage_Sensing (R100.1), Connectors#2 (J6.5)
NetJ6_6: Voltage_Sensing (R101.1), Connectors#2 (J6.6)
NetJ6_7: Voltage_Sensing (R102.1), Connectors#2 (J6.7)
NetJ6_8: Voltage_Sensing (R103.1), Connectors#2 (J6.8)
NetJ6_9: Voltage_Sensing (R104.1), Connectors#2 (J6.9)
NetJ6_10: Voltage_Sensing (R105.1), Connectors#2 (J6.10)
NetJ6_11: Voltage_Sensing (R106.1), Connectors#2 (J6.11)
NetJ6_12: Voltage_Sensing (R107.1), Connectors#2 (J6.12)
NetJ6_13: Voltage_Sensing (R108.1), Connectors#2 (J6.13)
NetJ6_14: Voltage_Sensing (R109.1), Connectors#2 (J6.14)
NetJ6_15: Voltage_Sensing (R110.1), Connectors#2 (J6.15)
NetJ7_1: Voltage_Sensing (R81.1), Connectors#2 (J7.1)
NetJ7_2: Voltage_Sensing (R82.1), Connectors#2 (J7.2)
NetJ7_3: Voltage_Sensing (R83.1), Connectors#2 (J7.3)
NetJ7_4: Voltage_Sensing (R84.1), Connectors#2 (J7.4)
NetJ7_5: Voltage_Sensing (R85.1), Connectors#2 (J7.5)
NetJ7_6: Voltage_Sensing (R86.1), Connectors#2 (J7.6)
NetJ7_7: Voltage_Sensing (R87.1), Connectors#2 (J7.7)
NetJ7_8: Voltage_Sensing (R88.1), Connectors#2 (J7.8)
NetJ7_9: Voltage_Sensing (R89.1), Connectors#2 (J7.9)
NetJ7_10: Voltage_Sensing (R90.1), Connectors#2 (J7.10)
NetJ7_11: Voltage_Sensing (R91.1), Connectors#2 (J7.11)
NetJ7_12: Voltage_Sensing (R92.1), Connectors#2 (J7.12)
NetJ7_13: Voltage_Sensing (R93.1), Connectors#2 (J7.13)
NetJ7_14: Voltage_Sensing (R94.1), Connectors#2 (J7.14)
NetJ7_15: Voltage_Sensing (R95.1), Connectors#2 (J7.15)
NetP1_1: Connectors#1 (P1.1), AFE (U11.61)
NetP1_2: Connectors#1 (P1.2), AFE (U11.60)
NetP1_3: Connectors#1 (P1.3), AFE (U11.59)
NetU01_15: Communication (U43.13), STMF1 (U01.15)
NRST: STMF1 (U01.7), Connectors#1 (J1.5 P3.12)
PROG_N: STMF1 (U01.43), Connectors#1 (J1.7 P3.13)
PROG_P: STMF1 (U01.42), Connectors#1 (J1.6 P3.14)
TOT_CURR: STMF1 (U01.11), Power (C14.1 R12.2), Connectors#2 (J19.1)
UART1_N: Communication (U43.11), STMF1 (U01.16)
UART1_P: Communication (U43.14), STMF1 (U01.17)
UPPER_VOL: STMF1 (U01.9), Power (C150.2 R151.2 U16.4), Connectors#2 (J17.1)
VC11: AFE (U11.13), Voltage_Sensing (C91.1 C92.2 R92.2)
VC21: AFE (U12.21), Voltage_Sensing (C102.1 C103.2 R103.2)